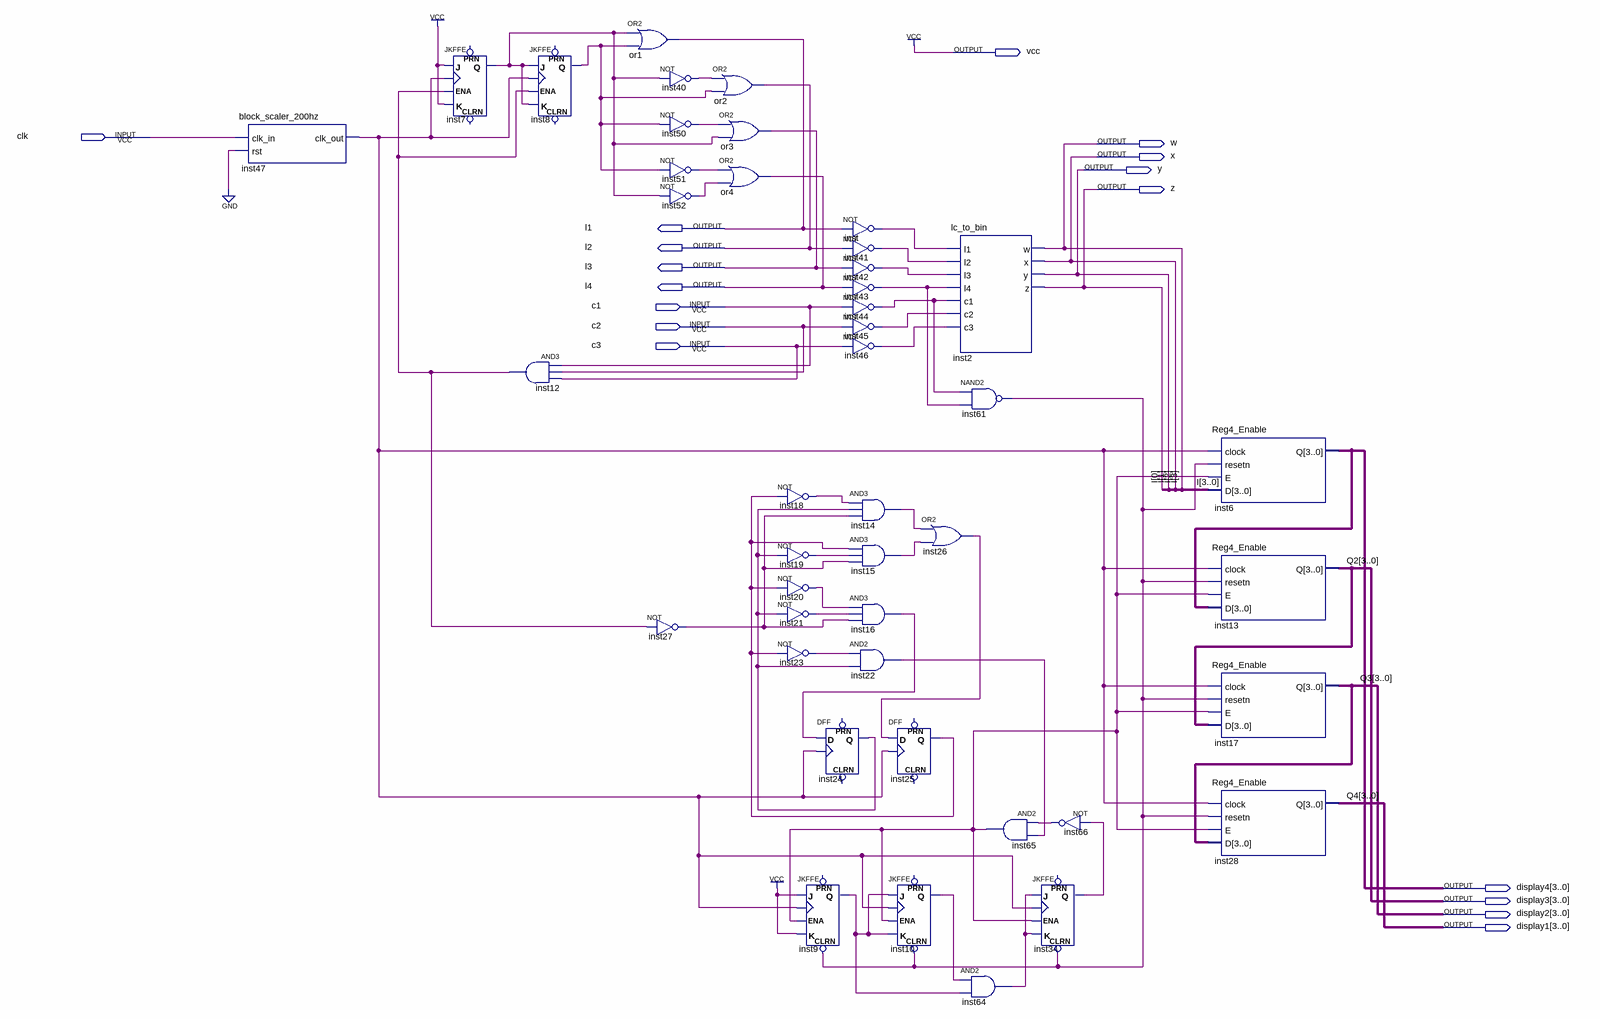
[diagram p0: schematic sheet]
// Quartus schematic TECLADO.bdf as structural Verilog: 44 symbols, 17 pins
module TECLADO (
  input  clk,
  input  c1,
  input  c2,
  input  c3,
  output vcc,
  output w,
  output x,
  output y,
  output z,
  output l1,
  output l2,
  output l3,
  output l4,
  output [3:0] display4,
  output [3:0] display3,
  output [3:0] display2,
  output [3:0] display1
);

  wire inst7_q, inst8_q, inst9_q, inst10_q, inst12_out, inst14_out, inst15_out, inst16_out, inst18_out,
       inst19_out, inst20_out, inst21_out, inst22_out, inst23_out, inst24_q, inst25_q, inst26_out,
       inst27_out, inst34_q, inst40_out, inst41_out, inst42_out, inst43_out, inst44_out, inst45_out,
       inst46_out, inst47_clk_out, inst50_out, inst51_out, inst52_out, inst61_out, inst64_out, inst65_out,
       inst66_out, inst_out;

  block_scaler_200hz inst47 (.clk_in(clk), .rst(1'b0), .clk_out(inst47_clk_out));
  JKFFE inst7 (.J(1'b1), .CLK(inst47_clk_out), .K(1'b1), .ENA(inst12_out), .Q(inst7_q));  // open: PRN, CLRN
  JKFFE inst8 (.J(inst7_q), .CLK(inst47_clk_out), .K(inst7_q), .ENA(inst12_out), .Q(inst8_q));  // open: PRN, CLRN
  and inst12 (inst12_out, c1, c2, c3);
  or or1 (l1, inst7_q, inst8_q);
  not inst27 (inst27_out, inst12_out);
  not inst40 (inst40_out, inst7_q);
  not inst50 (inst50_out, inst8_q);
  not inst51 (inst51_out, inst8_q);
  not inst52 (inst52_out, inst7_q);
  or or2 (l2, inst40_out, inst8_q);
  or or3 (l3, inst50_out, inst7_q);
  or or4 (l4, inst51_out, inst52_out);
  not inst18 (inst18_out, inst25_q);
  not inst19 (inst19_out, inst24_q);
  not inst20 (inst20_out, inst25_q);
  not inst21 (inst21_out, inst24_q);
  not inst23 (inst23_out, inst25_q);
  JKFFE inst9 (
    .J(1'b1), .CLK(inst47_clk_out), .CLRN(inst61_out), .K(1'b1), .ENA(inst65_out), .Q(inst9_q));  // open: PRN
  not inst (inst_out, l1);
  not inst41 (inst41_out, l2);
  not inst42 (inst42_out, l3);
  not inst43 (inst43_out, l4);
  not inst44 (inst44_out, c1);
  not inst45 (inst45_out, c2);
  not inst46 (inst46_out, c3);
  and inst14 (inst14_out, inst18_out, inst24_q, inst27_out);
  and inst15 (inst15_out, inst25_q, inst19_out, inst27_out);
  and inst16 (inst16_out, inst20_out, inst21_out, inst27_out);
  and inst22 (inst22_out, inst23_out, inst24_q);
  DFF inst24 (.CLK(inst47_clk_out), .D(inst16_out), .Q(inst24_q));  // open: CLRN, PRN
  DFF inst25 (.CLK(inst47_clk_out), .D(inst26_out), .Q(inst25_q));  // open: CLRN, PRN
  JKFFE inst10 (
    .J(inst9_q), .CLK(inst47_clk_out), .CLRN(inst61_out), .K(inst9_q), .ENA(inst65_out), .Q(inst10_q));  // open: PRN
  lc_to_bin inst2 (
    .l1(inst_out), .l2(inst41_out), .l3(inst42_out), .l4(inst43_out), .c1(inst44_out), .c2(inst45_out),
    .c3(inst46_out), .w(w), .x(x), .y(y), .z(z));
  nand inst61 (inst61_out, inst44_out, inst43_out);
  or inst26 (inst26_out, inst14_out, inst15_out);
  and inst64 (inst64_out, inst10_q, inst9_q);
  and inst65 (inst65_out, inst66_out, inst22_out);
  not inst66 (inst66_out, inst34_q);
  JKFFE inst34 (
    .J(inst64_out), .CLK(inst47_clk_out), .CLRN(inst61_out), .K(inst64_out), .ENA(inst65_out), .Q(inst34_q));  // open: PRN
  Reg4_Enable inst6 (.clock(inst47_clk_out), .resetn(inst61_out), .E(inst65_out), .D({w, x, y, z}), .Q(display4));
  Reg4_Enable inst13 (.clock(inst47_clk_out), .resetn(inst61_out), .E(inst65_out), .D(display4), .Q(display3));
  Reg4_Enable inst17 (.clock(inst47_clk_out), .resetn(inst61_out), .E(inst65_out), .D(display3), .Q(display2));
  Reg4_Enable inst28 (.clock(inst47_clk_out), .resetn(inst61_out), .E(inst65_out), .D(display2), .Q(display1));

  assign vcc = 1'b1;

  // Other names for the same wires on the sheet: Q4[3:0] = display1; Q3[3:0] = display2; Q2[3:0] = display3;
  //   I[3:0] = {w, x, y, z}
endmodule
